# EAGLE schematic digitboard (EAGLE 6.6.0)
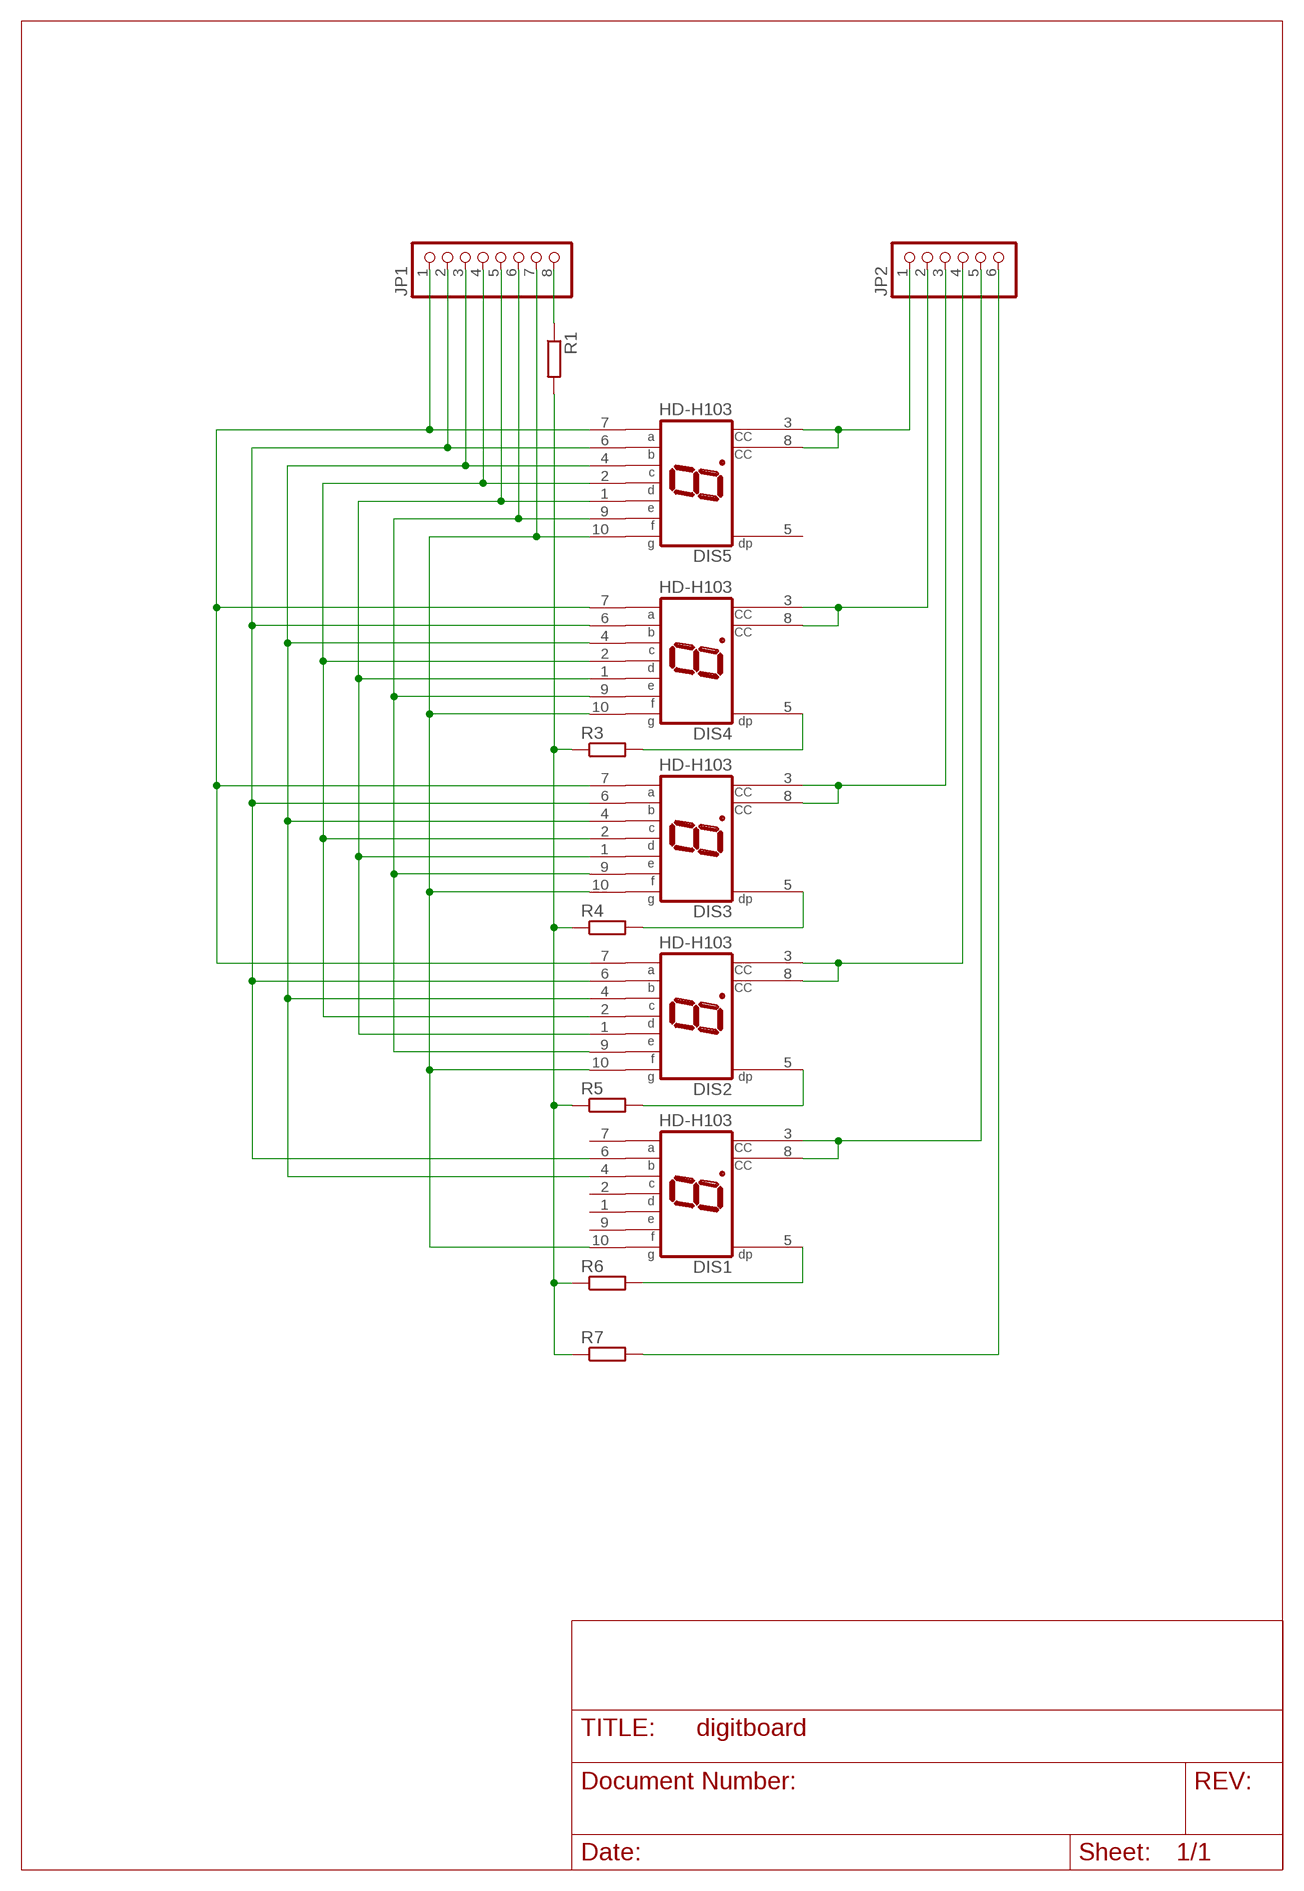
[diagram p0: schematic, sheet 1]

## Parts
DIS1  HD-H103  [HDSP-M]
DIS2  HD-H103  [HDSP-M]
DIS3  HD-H103  [HDSP-M]
DIS4  HD-H103  [HDSP-M]
DIS5  HD-H103  [HDSP-M]
JP1  PINHD-1X8  [1X08]
JP2  PINHD-1X6  [1X06]
R1  R-EU_R0603  [R0603]
R3  R-EU_R0603  [R0603]
R4  R-EU_R0603  [R0603]
R5  R-EU_R0603  [R0603]
R6  R-EU_R0603  [R0603]
R7  R-EU_R0603  [R0603]

## Nets
N$1: JP2.6 R7.2
N$2: R1.2 R3.1 R4.1 R5.1 R6.1 R7.1
N$3: JP1.8 R1.1
N$5: DIS4.5(DP) R3.2
N$6: DIS3.5(DP) R4.2
N$7: DIS2.5(DP) R5.2
N$8: DIS1.5(DP) R6.2
N$42: DIS2.7(A) DIS3.7(A) DIS4.7(A) DIS5.7(A) JP1.1
N$43: DIS1.6(B) DIS2.6(B) DIS3.6(B) DIS4.6(B) DIS5.6(B) JP1.2
N$44: DIS1.4(C) DIS2.4(C) DIS3.4(C) DIS4.4(C) DIS5.4(C) JP1.3
N$45: DIS2.2(D) DIS3.2(D) DIS4.2(D) DIS5.2(D) JP1.4
N$46: DIS2.1(E) DIS3.1(E) DIS4.1(E) DIS5.1(E) JP1.5
N$47: DIS2.9(F) DIS3.9(F) DIS4.9(F) DIS5.9(F) JP1.6
N$48: DIS1.10(G) DIS2.10(G) DIS3.10(G) DIS4.10(G) DIS5.10(G) JP1.7
N$50: DIS5.3(CC) DIS5.8(CC) JP2.1
N$51: DIS4.3(CC) DIS4.8(CC) JP2.2
N$52: DIS3.3(CC) DIS3.8(CC) JP2.3
N$53: DIS2.3(CC) DIS2.8(CC) JP2.4
N$54: DIS1.3(CC) DIS1.8(CC) JP2.5
Unconnected: DIS1.1(E) DIS1.2(D) DIS1.7(A) DIS1.9(F) DIS5.5(DP)

## Library data of the parts
DIS1-DIS5 = display-hp:HD-H103: LED DISPLAY 1-character 7 segment, decimal point right; OC_FARNELL: unknown; OC_NEWARK: unknown
JP1 = pinhead:PINHD-1X8: PIN HEADER
JP2 = pinhead:PINHD-1X6: PIN HEADER
R1 R3-R7 = rcl:R-EU_: RESISTOR, European symbol